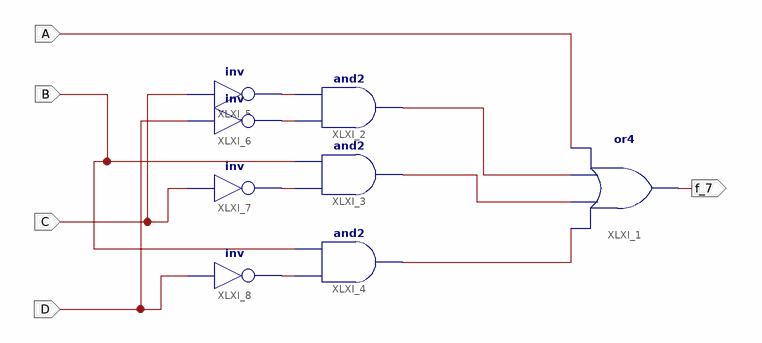
[diagram p0: schematic sheet 1]
// Xilinx ISE schematic bcd_for_f.sch (spartan6) as structural Verilog: 8 symbols, 5 ports
module bcd_for_f (
  input  A,
  input  B,
  input  C,
  input  D,
  output f_7
);

  wire XLXN_1, XLXN_2, XLXN_3, XLXN_4, XLXN_13, XLXN_14, XLXN_15;

  or XLXI_1 (f_7, XLXN_15, XLXN_14, XLXN_13, A);
  and XLXI_2 (XLXN_13, XLXN_2, XLXN_1);
  and XLXI_3 (XLXN_14, XLXN_3, B);
  and XLXI_4 (XLXN_15, XLXN_4, B);
  not XLXI_5 (XLXN_1, C);
  not XLXI_6 (XLXN_2, D);
  not XLXI_7 (XLXN_3, C);
  not XLXI_8 (XLXN_4, D);
endmodule
